# EAGLE design outsim uno (EAGLE 7.4.0)
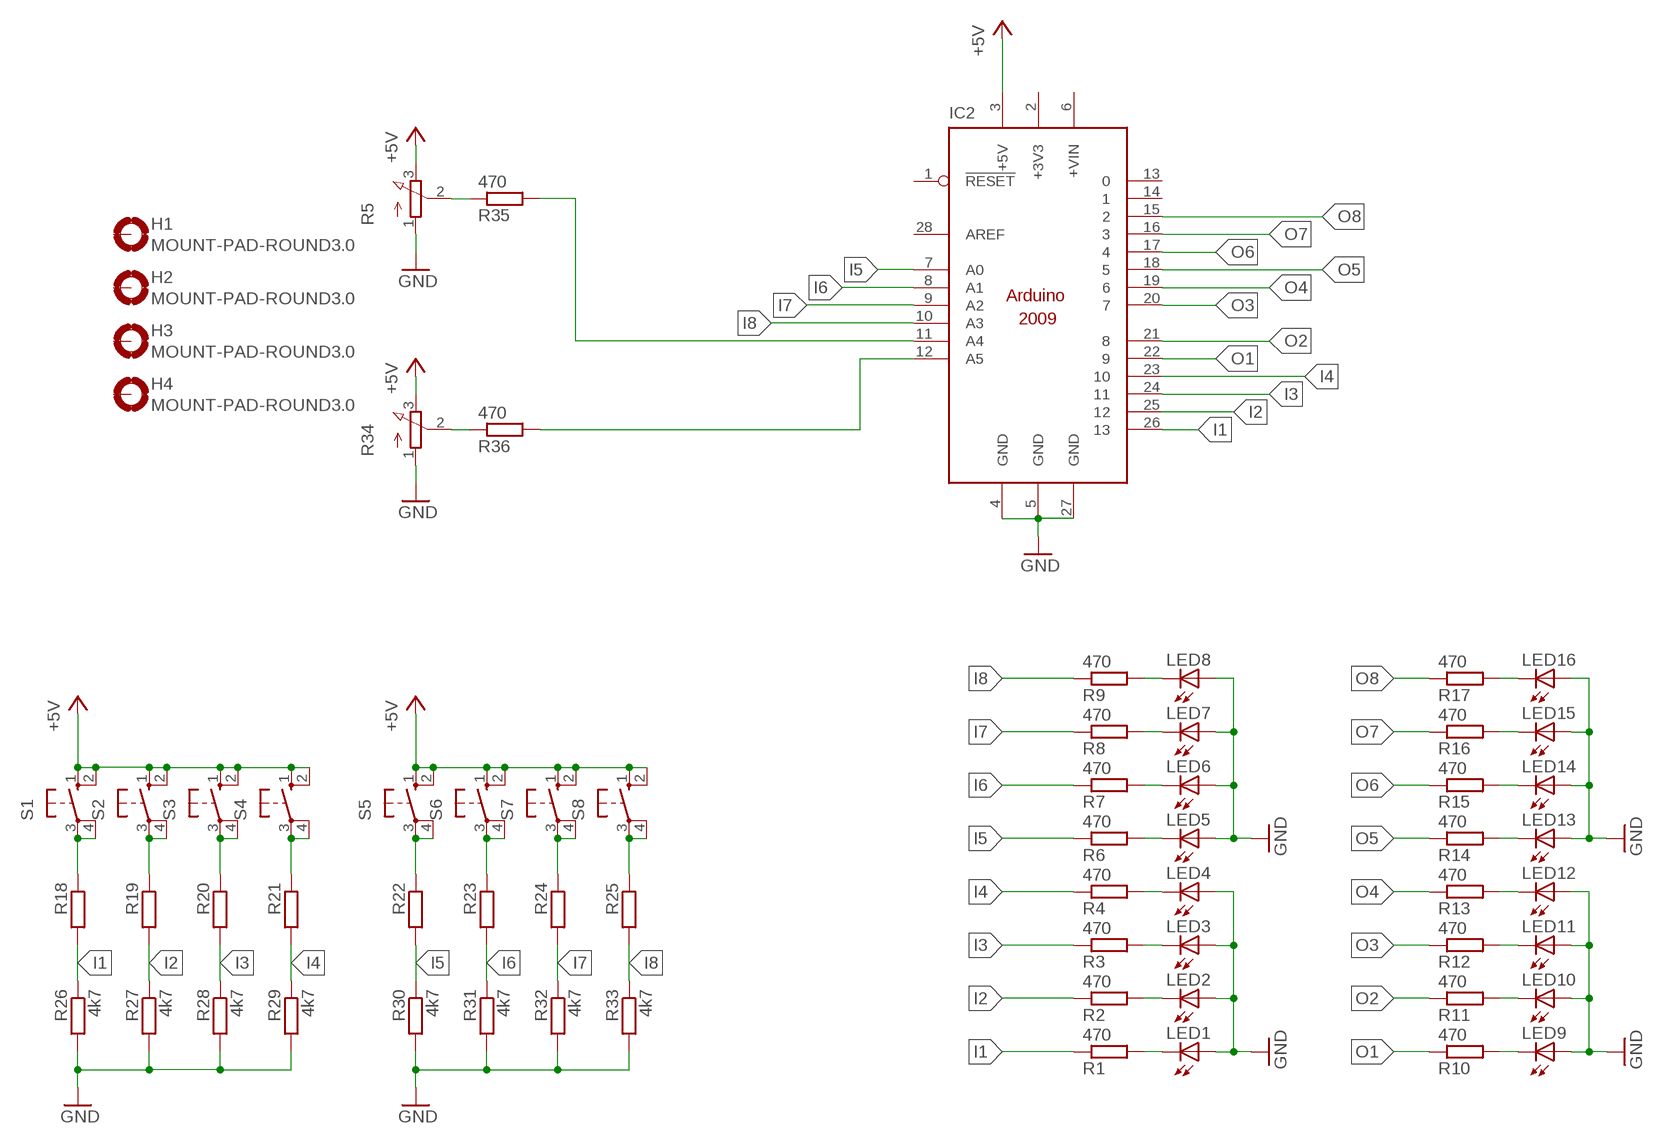
[diagram p0: schematic, sheet 1]

## Parts
H1  MOUNT-PAD-ROUND3.0  [3,0-PAD]
H2  MOUNT-PAD-ROUND3.0  [3,0-PAD]
H3  MOUNT-PAD-ROUND3.0  [3,0-PAD]
H4  MOUNT-PAD-ROUND3.0  [3,0-PAD]
IC2  ARDUINO2009_12  [ARDUINO2009_2]
LED1  LED5MM  [LED5MM]
LED2  LED5MM  [LED5MM]
LED3  LED5MM  [LED5MM]
LED4  LED5MM  [LED5MM]
LED5  LED5MM  [LED5MM]
LED6  LED5MM  [LED5MM]
LED7  LED5MM  [LED5MM]
LED8  LED5MM  [LED5MM]
LED9  LED5MM  [LED5MM]
LED10  LED5MM  [LED5MM]
LED11  LED5MM  [LED5MM]
LED12  LED5MM  [LED5MM]
LED13  LED5MM  [LED5MM]
LED14  LED5MM  [LED5MM]
LED15  LED5MM  [LED5MM]
LED16  LED5MM  [LED5MM]
R1  470  R-EU_0207/10  [0207/10]
R2  470  R-EU_0207/10  [0207/10]
R3  470  R-EU_0207/10  [0207/10]
R4  470  R-EU_0207/10  [0207/10]
R5  3RP/1610N  [3RP/1610N]
R6  470  R-EU_0207/10  [0207/10]
R7  470  R-EU_0207/10  [0207/10]
R8  470  R-EU_0207/10  [0207/10]
R9  470  R-EU_0207/10  [0207/10]
R10  470  R-EU_0207/10  [0207/10]
R11  470  R-EU_0207/10  [0207/10]
R12  470  R-EU_0207/10  [0207/10]
R13  470  R-EU_0207/10  [0207/10]
R14  470  R-EU_0207/10  [0207/10]
R15  470  R-EU_0207/10  [0207/10]
R16  470  R-EU_0207/10  [0207/10]
R17  470  R-EU_0207/10  [0207/10]
R18  R-EU_0207/10  [0207/10]
R19  R-EU_0207/10  [0207/10]
R20  R-EU_0207/10  [0207/10]
R21  R-EU_0207/10  [0207/10]
R22  R-EU_0207/10  [0207/10]
R23  R-EU_0207/10  [0207/10]
R24  R-EU_0207/10  [0207/10]
R25  R-EU_0207/10  [0207/10]
R26  4k7  R-EU_0207/10  [0207/10]
R27  4k7  R-EU_0207/10  [0207/10]
R28  4k7  R-EU_0207/10  [0207/10]
R29  4k7  R-EU_0207/10  [0207/10]
R30  4k7  R-EU_0207/10  [0207/10]
R31  4k7  R-EU_0207/10  [0207/10]
R32  4k7  R-EU_0207/10  [0207/10]
R33  4k7  R-EU_0207/10  [0207/10]
R34  3RP/1610N  [3RP/1610N]
R35  470  R-EU_0207/10  [0207/10]
R36  470  R-EU_0207/10  [0207/10]
S1  10-XX  [B3F-10XX]
S2  10-XX  [B3F-10XX]
S3  10-XX  [B3F-10XX]
S4  10-XX  [B3F-10XX]
S5  10-XX  [B3F-10XX]
S6  10-XX  [B3F-10XX]
S7  10-XX  [B3F-10XX]
S8  10-XX  [B3F-10XX]

## Nets
+5V: IC2.3(+5V) R5.3(E) R34.3(E) S1.1(S) S1.2(S1) S2.1(S) S2.2(S1) S3.1(S) S3.2(S1) S4.1(S) S4.2(S1) S5.1(S) S5.2(S1) S6.1(S) S6.2(S1) S7.1(S) S7.2(S1) S8.1(S) S8.2(S1)
GND: IC2.4(GND) IC2.5(GND) IC2.27(GND) LED1.A LED2.A LED3.A LED4.A LED5.A LED6.A LED7.A LED8.A LED9.A LED10.A LED11.A LED12.A LED13.A LED14.A LED15.A LED16.A R5.1(A) R26.2 R27.2 R28.2 R29.2 R30.2 R31.2 R32.2 R33.2 R34.1(A)
I1: IC2.26 R1.1 R18.2 R26.1
I2: IC2.25 R2.1 R19.2 R27.1
I3: IC2.24 R3.1 R20.2 R28.1
I4: IC2.23 R4.1 R21.2 R29.1
I5: IC2.7(A0) R6.1 R22.2 R30.1
I6: IC2.8(A1) R7.1 R23.2 R31.1
I7: IC2.9(A2) R8.1 R24.2 R32.1
I8: IC2.10(A3) R9.1 R25.2 R33.1
N$1: R34.2(S) R36.1
N$2: LED5.K(C) R6.2
N$3: LED6.K(C) R7.2
N$4: LED7.K(C) R8.2
N$5: LED1.K(C) R1.2
N$6: LED2.K(C) R2.2
N$7: LED3.K(C) R3.2
N$8: LED4.K(C) R4.2
N$9: IC2.12(A5) R36.2
N$10: R20.1 S3.3(P) S3.4(P1)
N$11: LED8.K(C) R9.2
N$12: LED9.K(C) R10.2
N$13: LED10.K(C) R11.2
N$14: LED11.K(C) R12.2
N$15: LED12.K(C) R13.2
N$16: LED13.K(C) R14.2
N$17: R18.1 S1.3(P) S1.4(P1)
N$18: R19.1 S2.3(P) S2.4(P1)
N$19: LED14.K(C) R15.2
N$20: LED15.K(C) R16.2
N$21: LED16.K(C) R17.2
N$22: IC2.11(A4) R35.2
N$23: R5.2(S) R35.1
N$28: R21.1 S4.3(P) S4.4(P1)
N$29: R22.1 S5.3(P) S5.4(P1)
N$30: R23.1 S6.3(P) S6.4(P1)
N$32: R24.1 S7.3(P) S7.4(P1)
N$36: R25.1 S8.3(P) S8.4(P1)
O1: IC2.22 R10.1
O2: IC2.21 R11.1
O3: IC2.20 R12.1
O4: IC2.19 R13.1
O5: IC2.18 R14.1
O6: IC2.17 R15.1
O7: IC2.16 R16.1
O8: IC2.15 R17.1
Unconnected: H1.B3,0(MOUNT) H2.B3,0(MOUNT) H3.B3,0(MOUNT) H4.B3,0(MOUNT) IC2.1(!RESET) IC2.6(+VIN) IC2.13 IC2.14 IC2.28(AREF)

## Power pins joined to a net without a drawn wire
+3V3: IC2.2(+3V3)

## Library data of the parts
H1-H4 = holes:MOUNT-PAD-ROUND: MOUNTING PAD, round
IC2 = arduino:ARDUINO2009_1: The Arduino Duemilanove ("2009") is a microcontroller board based on the ATmega168 or ATmega328. - 14 digital input/output pins (of which 6 can be used as PWM outputs) - 6 analog inputs, a 16 MHz crystal oscillator - USB connection - power jack - ISP header - reset button It contains everything needed to support the microcontroller; simply connect it to a computer with a USB cable or power it with a AC-to-DC adapter or battery to get started http://arduino.cc/en/Main/ArduinoBoardDuemilanove
LED1-LED16 = led:LED: LED OSRAM: - CHIPLED LG R971, LG N971, LY N971, LG Q971, LY Q971, LO R971, LY R971 LH N974, LH R974 LS Q976, LO Q976, LY Q976 LO Q996 - Hyper CHIPLED LW Q18S LB Q993, LB Q99A, LB R99A - SideLED LS A670, LO A670, LY A670, LG A670, LP A670 LB A673, LV A673, LT A673, LW A673 LH A674 LY A675 LS A676, LA A676, LO A676, LY A676, LW A676 LS A679, LY A679, LG A679 - Hyper Micro SIDELED® LS Y876, LA Y876, LO Y876, LY Y876 LT Y87S - SmartLED LW L88C, LW L88S LB L89C, LB L89S, LG L890 LS L89K, LO L89K, LY L89K LS L896, LA L896, LO L896, LY L896 - TOPLED LS T670, LO T670, LY T670, LG T670, LP T670 LSG T670, LSP T670, LSY T670, LOP T670, LYG T670 LG T671, LOG T671, LSG T671 LB T673, LV T673, LT T673, LW T673 LH T674 LS T676, LA T676, LO T676, LY T676, LB T676, LH T676, LSB T676, LW T676 LB T67C, LV T67C, LT T67C, LS T67K, LO T67K, LY T67K, LW E67C LS E67B, LA E67B, LO E67B, LY E67B, LB E67C, LV E67C, LT E67C LW T67C LS T679, LY T679, LG T679 LS T770, LO T770, LY T770, LG T770, LP T770 LB T773, LV T773, LT T773, LW T773 LH T774 LS E675, LA E675, LY E675, LS T675 LS T776, LA T776, LO T776, LY T776, LB T776 LHGB T686 LT T68C, LB T68C - Hyper Mini TOPLED® LB M676 - Mini TOPLED Santana® LG M470 LS M47K, LO M47K, LY M47K Source: http://www.osram.convergy.de LUXEON: - LUMILED® LXK2-PW12-R00, LXK2-PW12-S00, LXK2-PW14-U00, LXK2-PW14-V00 LXK2-PM12-R00, LXK2-PM12-S00, LXK2-PM14-U00 LXK2-PE12-Q00, LXK2-PE12-R00, LXK2-PE12-S00, LXK2-PE14-T00, LXK2-PE14-U00 LXK2-PB12-K00, LXK2-PB12-L00, LXK2-PB12-M00, LXK2-PB14-N00, LXK2-PB14-P00, LXK2-PB14-Q00 LXK2-PR12-L00, LXK2-PR12-M00, LXK2-PR14-Q00, LXK2-PR14-R00 LXK2-PD12-Q00, LXK2-PD12-R00, LXK2-PD12-S00 LXK2-PH12-R00, LXK2-PH12-S00 LXK2-PL12-P00, LXK2-PL12-Q00, LXK2-PL12-R00 Source: www.luxeon.com KINGBRIGHT: KA-3528ASYC Source: www.kingbright.com
R1-R4 R6-R33 R35 R36 = rcl:R-EU_: RESISTOR, European symbol
R5 R34 = pot:3RP/1610N: 16mm Potentiometer one level Source: http://www.alphapotentiometers.net/html/16mm_pot_2.html
S1-S8 = switch-omron:10-XX: OMRON SWITCH; MPN: B3F-1000; OC_FARNELL: 176432; OC_NEWARK: 36M3542

## Board
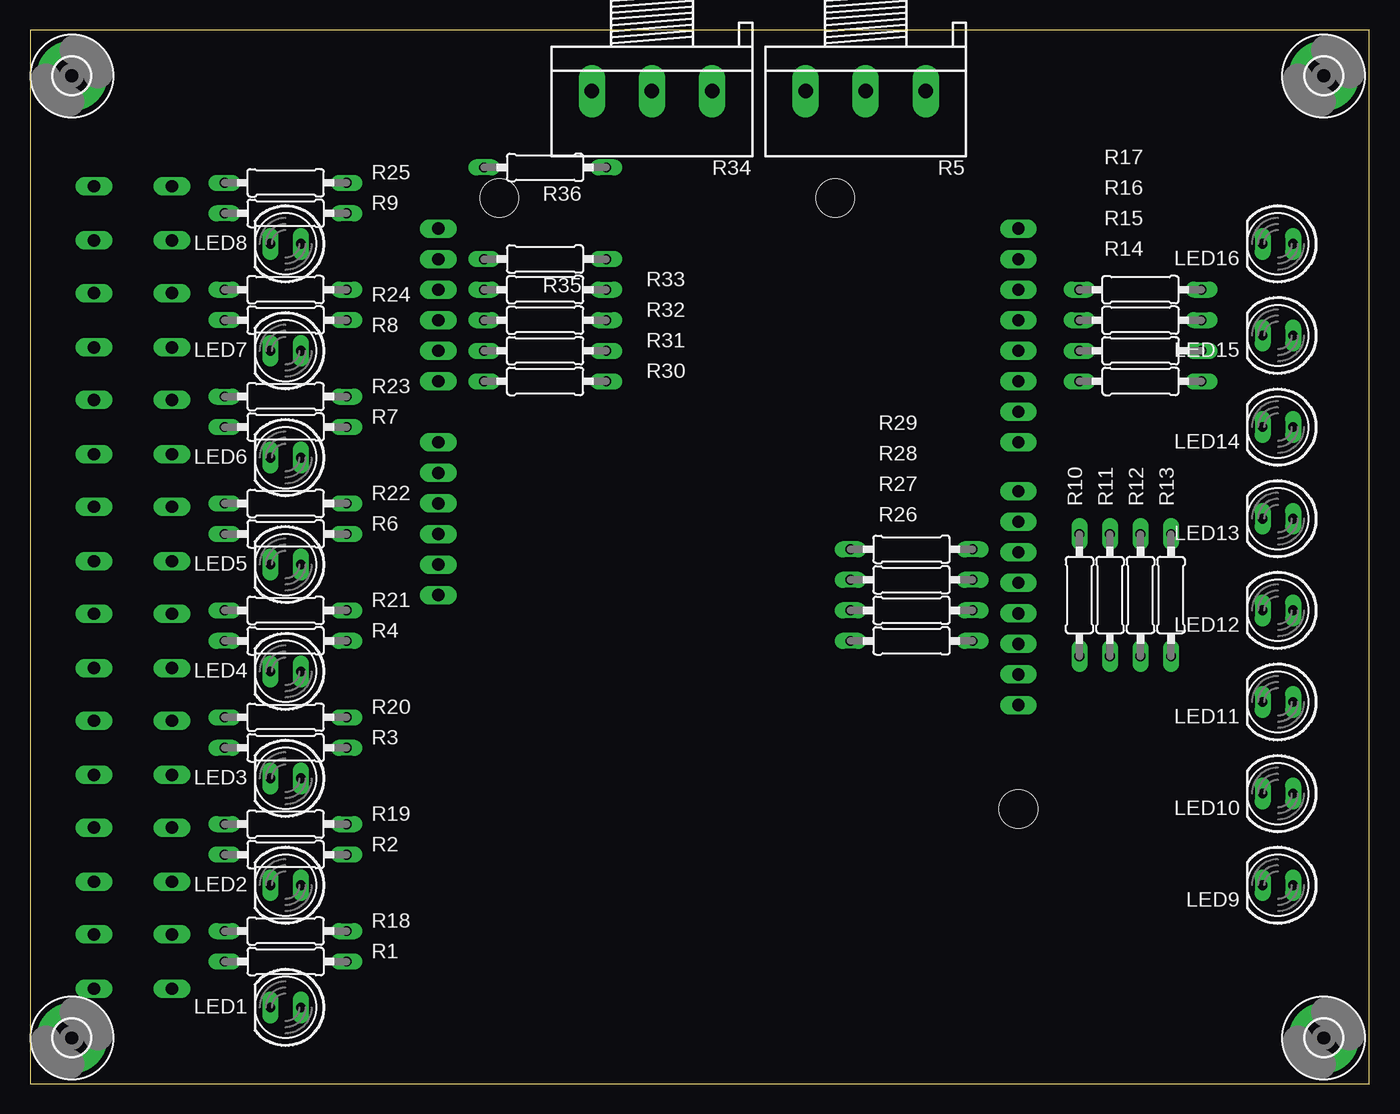
[diagram p1: board, top side]
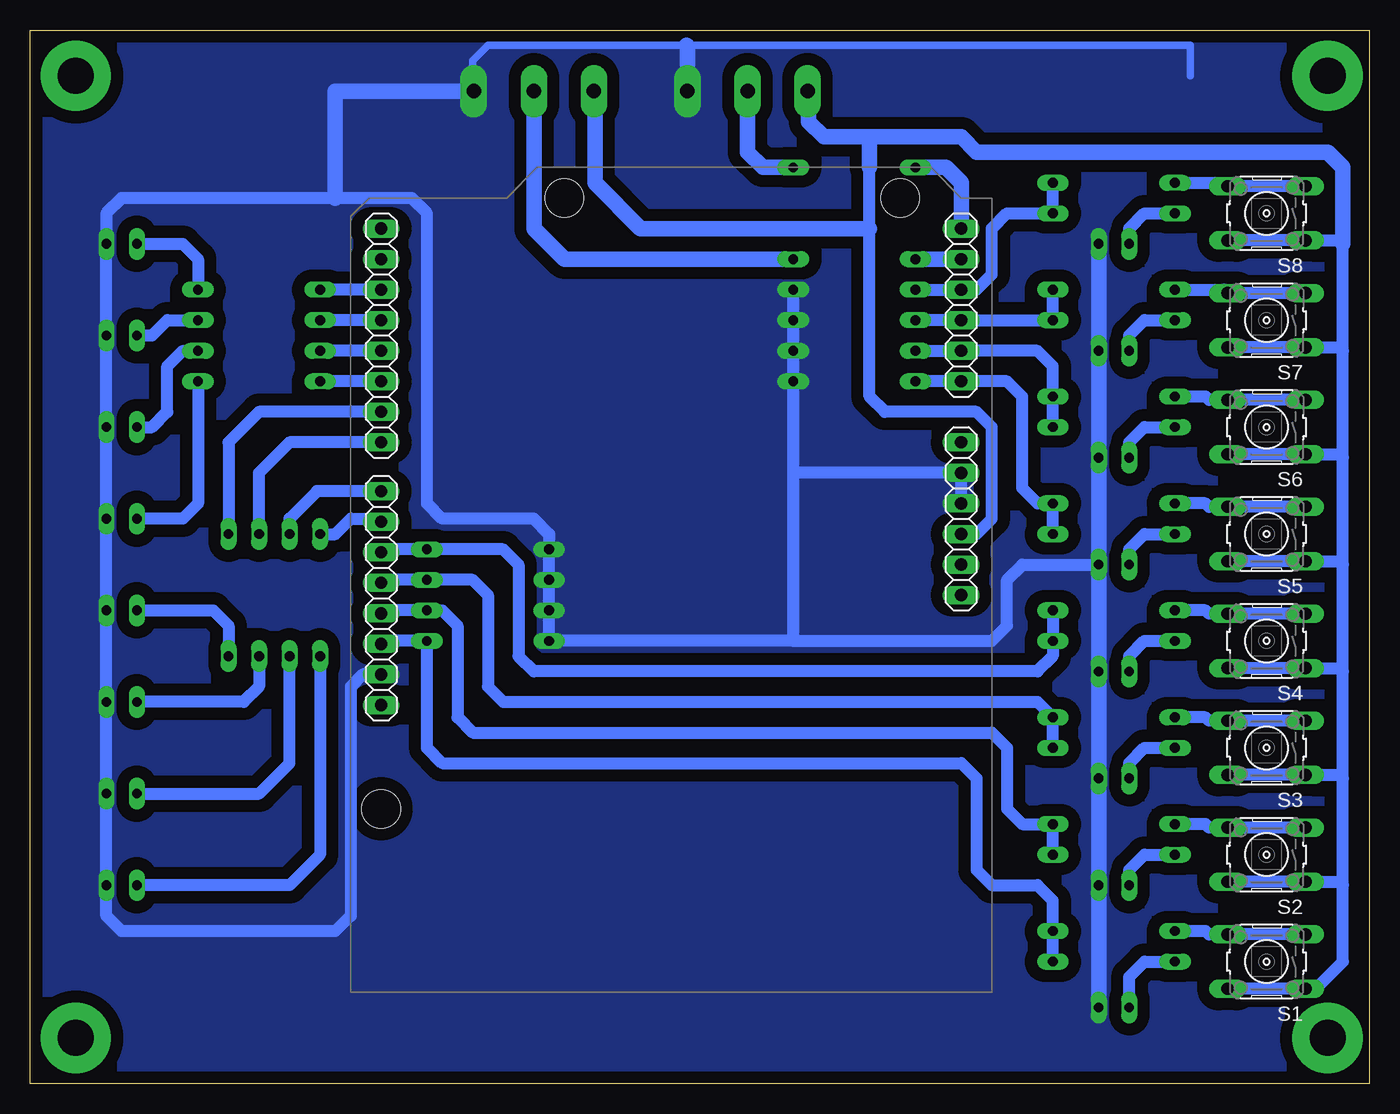
[diagram p2: board, bottom side, seen from below]

Size 111.43 x 87.61 mm. Coordinates in mm from the lower left corner, seen from the top.
Outline: 111.43,0 111.43,87.61 0,87.61 0,0 111.43,0
Copper layers (1*16): Top 0.035mm / dielectric 1.5mm / Bottom 0.035mm
Design rules "default": minimum track width 10mil, minimum drill 24mil, track to track 8mil, track to pad 8mil, pad to pad 8mil, via to via 8mil, smd to smd 8mil, copper to edge 40mil, drill to drill 8mil, minimum pad ring 10mil, minimum via ring 8mil, stop-mask expansion 4mil, vias tented up to drill 0mil, thermal gap 10mil

### Footprints (pad centres in the part's own frame; a part is rotated, then mirrored left to right if it is on the bottom)
3,0-PAD = drill 3 pad 5.842: B3,0 0,0
ARDUINO2009_2 = drill 1.016 long: 1 33.02,2.54; 2 35.56,2.54; 3 38.1,2.54; 4 40.64,2.54; 5 43.18,2.54; 6 45.72,2.54; 7 50.8,2.54; 8 53.34,2.54; 9 55.88,2.54; 10 58.42,2.54; 11 60.96,2.54; 12 63.5,2.54; 13 63.5,50.8; 14 60.96,50.8; 15 58.42,50.8; 16 55.88,50.8; 17 53.34,50.8; 18 50.8,50.8; 19 48.26,50.8; 20 45.72,50.8; 21 41.656,50.8; 22 39.116,50.8; 23 36.576,50.8; 24 34.036,50.8; 25 31.496,50.8; 26 28.956,50.8; 27 26.416,50.8; 28 23.876,50.8 | hole 3.2: 15.24,50.8; 66.04,35.56; 66.04,7.62
LED5MM = drill 0.813 long: A -1.27,0; K 1.27,0
0207/10 = drill 0.813 long: 1 -5.08,0; 2 5.08,0
3RP/1610N = drill 1.2 pad 2.184 long: 1 -5,0; 2 0,0; 3 5,0
B3F-10XX = drill 1.016 long: 1 -3.251,2.261; 2 3.251,2.261; 3 -3.251,-2.261; 4 3.251,-2.261

### Placement (x,y rotation side)
H1  3.48,3.81 0 top
H2  107.62,3.81 0 top
H3  107.62,83.82 0 top
H4  3.48,83.82 0 top
IC2  31.42,7.62 90 bottom
LED1  21.26,6.35 180 top
LED2  21.26,16.51 180 top
LED3  21.26,25.4 180 top
LED4  21.26,34.29 180 top
LED5  21.26,43.18 180 top
LED6  21.26,52.07 180 top
LED7  21.26,60.96 180 top
LED8  21.26,69.85 180 top
LED9  103.81,16.51 180 top
LED10  103.81,24.13 180 top
LED11  103.81,31.75 180 top
LED12  103.81,39.37 180 top
LED13  103.81,46.99 180 top
LED14  103.81,54.61 180 top
LED15  103.81,62.23 180 top
LED16  103.81,69.85 180 top
R1  21.26,10.16 180 top
R2  21.26,19.05 180 top
R3  21.26,27.94 180 top
R4  21.26,36.83 180 top
R5  69.52,82.55 180 top
R6  21.26,45.72 180 top
R7  21.26,54.61 180 top
R8  21.26,63.5 180 top
R9  21.26,72.39 180 top
R10  87.3,40.64 270 top
R11  89.84,40.64 270 top
R12  92.38,40.64 270 top
R13  94.92,40.64 270 top
R14  92.38,58.42 0 top
R15  92.38,60.96 0 top
R16  92.38,63.5 0 top
R17  92.38,66.04 0 top
R18  21.26,12.7 0 top
R19  21.26,21.59 0 top
R20  21.26,30.48 0 top
R21  21.26,39.37 0 top
R22  21.26,48.26 0 top
R23  21.26,57.15 0 top
R24  21.26,66.04 0 top
R25  21.26,74.93 0 top
R26  73.33,36.83 180 top
R27  73.33,39.37 180 top
R28  73.33,41.91 180 top
R29  73.33,44.45 180 top
R30  42.85,58.42 0 top
R31  42.85,60.96 0 top
R32  42.85,63.5 0 top
R33  42.85,66.04 0 top
R34  51.74,82.55 180 top
R35  42.85,68.58 180 top
R36  42.85,76.2 180 top
S1  8.56,10.16 180 bottom
S2  8.56,19.05 180 bottom
S3  8.56,27.94 180 bottom
S4  8.56,36.83 180 bottom
S5  8.56,45.72 180 bottom
S6  8.56,54.61 180 bottom
S7  8.56,63.5 180 bottom
S8  8.56,72.39 180 bottom

### Tracks (layer width: path | path; a pad name or v marks a point on that pad's centre or on a via)
+5V
  Bottom 1.016: S8.2 S8.1 2.49,70.13 | S7.2 S7.1 2.49,61.24 2.21,60.96 | S6.2 S6.1 2.49,52.35 2.21,52.07 | S5.2 S5.1 2.49,43.46 2.21,43.18 | S4.2 S4.1 2.49,34.57 2.21,34.29 | S2.2 S2.1 2.49,16.79 2.21,16.51 | S3.2 S3.1 2.49,25.68 2.21,25.4 | S1.2 S1.1 4.47,7.9 2.21,10.16 2.21,16.51 | 2.21,16.51 2.21,25.4 | 2.21,25.4 2.21,34.29 | 2.21,34.29 2.21,43.18 | 2.21,43.18 2.21,52.07 | 2.21,52.07 2.21,60.96 | 2.21,60.96 2.21,69.85 | 2.49,70.13 2.21,69.85 | IC2.3 32.69,45.72 31.42,46.99 31.42,54.61 32.69,55.88 40.31,55.88 41.58,57.15 41.58,71.12 41.58,76.2 | 2.21,69.85 2.21,70.41 2.49,70.13
  Bottom 1.27: R5.3 64.44,82.63 64.44,74.93 60.63,71.12 41.58,71.12 | 2.21,69.85 2.21,76.2 3.48,77.47 32.69,77.47 33.96,78.74 41.58,78.74 | 41.58,76.2 41.58,78.74 | 41.58,78.74 45.39,78.74 46.66,80.01 46.66,82.47 R34.3
GND
  Bottom 0.61: 14.91,83.82 14.91,86.36 56.82,86.36 73.33,86.36 74.6,85.09 74.6,82.63 R5.1
  Bottom 1.016: 47.93,50.8 IC2.5 IC2.4 | R33.2 R32.2 R31.2 R30.2 47.93,50.8 | IC2.27 83.74,34.04 84.76,33.02 84.76,13.97 86.03,12.7 103.81,12.7 105.08,13.97 LED9.A LED10.A LED11.A LED12.A LED13.A LED14.A LED15.A LED16.A 105.08,72.39 103.81,73.66 86.03,73.66 79.68,73.66 78.41,72.39 78.41,48.26 77.14,46.99 69.52,46.99 68.25,45.72 R29.2 R28.2 R26.2 | 47.93,36.83 31.42,36.83 30.15,38.1 30.15,41.91 28.88,43.18 LED5.A | 47.93,36.83 47.93,50.8 | R26.2 R27.2 | 47.93,36.83 R26.2
  Bottom 1.27: LED8.A LED7.A LED6.A LED5.A LED4.A LED3.A LED2.A LED1.A | R5.1 86.03,82.55 86.03,73.66 | R34.1 56.74,86.28 56.82,86.36
  pour Bottom (isolate 1.016, no thermals): 112.7,-1.27 112.7,88.9 -0.33,88.9 -1.6,-1.27
I1
  Bottom 1.016: IC2.26 81.97,36.83 R26.1 78.41,27.94 77.14,26.67 33.96,26.67 32.69,25.4 32.69,17.78 31.42,16.51 27.61,16.51 26.34,15.24 R18.2 R1.1
I2
  Bottom 1.016: IC2.25 81.97,39.37 R27.1 77.14,39.37 75.87,38.1 75.87,30.48 74.6,29.21 31.42,29.21 30.15,27.94 30.15,22.86 28.88,21.59 R19.2 R2.1
I3
  Bottom 1.016: IC2.24 81.97,41.91 R28.1 74.6,41.91 73.33,40.64 73.33,33.02 72.06,31.75 27.61,31.75 R20.2 R3.1
I4
  Bottom 1.016: IC2.23 81.97,44.45 R29.1 72.06,44.45 70.79,43.18 70.79,35.56 69.52,34.29 27.61,34.29 26.34,35.56 R4.1 R21.2
I5
  Bottom 1.016: R30.1 IC2.7 30.15,58.42 28.88,57.15 28.88,49.53 27.61,48.26 R22.2 R6.1
I6
  Bottom 1.016: R31.1 IC2.8 27.61,60.96 26.34,59.69 R23.2 R7.1
I7
  Bottom 1.016: R32.1 IC2.9 R8.1 R24.2
I8
  Bottom 1.016: R33.1 IC2.10 32.69,66.04 31.42,67.31 31.42,71.12 30.15,72.39 R9.1 R25.2
N$1
  Bottom 1.27: R34.2 51.74,77.47 50.47,76.2 R36.1
N$2
  Bottom 1.016: LED5.K 19.99,44.45 18.72,45.72 R6.2
N$3
  Bottom 1.016: LED6.K 19.99,53.34 18.72,54.61 R7.2
N$4
  Bottom 1.016: LED7.K 19.99,62.23 18.72,63.5 R8.2
N$5
  Bottom 1.016: LED1.K 19.99,8.89 18.72,10.16 R1.2
N$6
  Bottom 1.016: LED2.K 19.99,17.78 18.72,19.05 R2.2
N$7
  Bottom 1.016: LED3.K 19.99,26.67 18.72,27.94 R3.2
N$8
  Bottom 1.016: LED4.K 19.99,35.56 18.72,36.83 R4.2
N$9
  Bottom 1.27: IC2.12 33.96,74.93 35.23,76.2 R36.2
N$10
  Bottom 1.016: S3.3 S3.4 13.36,30.2 13.64,30.48 R20.1
N$11
  Bottom 1.016: LED8.K 19.99,71.12 18.72,72.39 R9.2
N$12
  Bottom 1.016: R10.2 87.3,19.05 89.84,16.51 LED9.K
N$13
  Bottom 1.016: LED10.K 92.38,24.13 89.84,26.67 R11.2
N$14
  Bottom 1.016: R12.2 92.38,33.02 93.65,31.75 LED11.K
N$15
  Bottom 1.016: LED12.K 96.19,39.37 94.92,38.1 R13.2
N$16
  Bottom 1.016: R14.2 97.46,48.26 98.73,46.99 LED13.K
N$17
  Bottom 1.016: S1.3 S1.4 13.36,12.42 13.64,12.7 R18.1
N$18
  Bottom 1.016: S2.3 S2.4 13.36,21.31 13.64,21.59 R19.1
N$19
  Bottom 1.016: LED14.K 101.27,54.61 100,55.88 100,59.69 98.73,60.96 R15.2
N$20
  Bottom 1.016: LED15.K 101.27,62.23 100,63.5 R16.2
N$21
  Bottom 1.016: LED16.K 98.73,69.85 97.46,68.58 R17.2
N$22
  Bottom 1.27: R35.2 IC2.11
N$23
  Bottom 1.27: R35.1 66.98,68.58 69.52,71.12 R5.2
N$28
  Bottom 1.016: S4.3 S4.4 13.36,39.09 13.64,39.37 R21.1
N$29
  Bottom 1.016: S5.3 S5.4 13.36,47.98 13.64,48.26 R22.1
N$30
  Bottom 1.016: S6.3 S6.4 13.36,56.87 13.64,57.15 R23.1
N$32
  Bottom 1.016: S7.3 S7.4 12.09,66.04 R24.1
N$36
  Bottom 1.016: S8.3 S8.4 12.09,74.93 R25.1
O1
  Bottom 1.016: R10.1 86.03,45.72 84.76,46.99 82.47,46.99 IC2.22
O2
  Bottom 1.016: IC2.21 87.55,49.28 89.84,46.99 R11.1
O3
  Bottom 1.016: R12.1 92.38,50.8 89.84,53.34 IC2.20
O4
  Bottom 1.016: IC2.19 92.38,55.88 94.92,53.34 R13.1
O5
  Bottom 1.016: IC2.18 R14.1
O6
  Bottom 1.016: IC2.17 R15.1
O7
  Bottom 1.016: IC2.16 R16.1
O8
  Bottom 1.016: IC2.15 R17.1